# Altium project test_nvme.PrjPcb
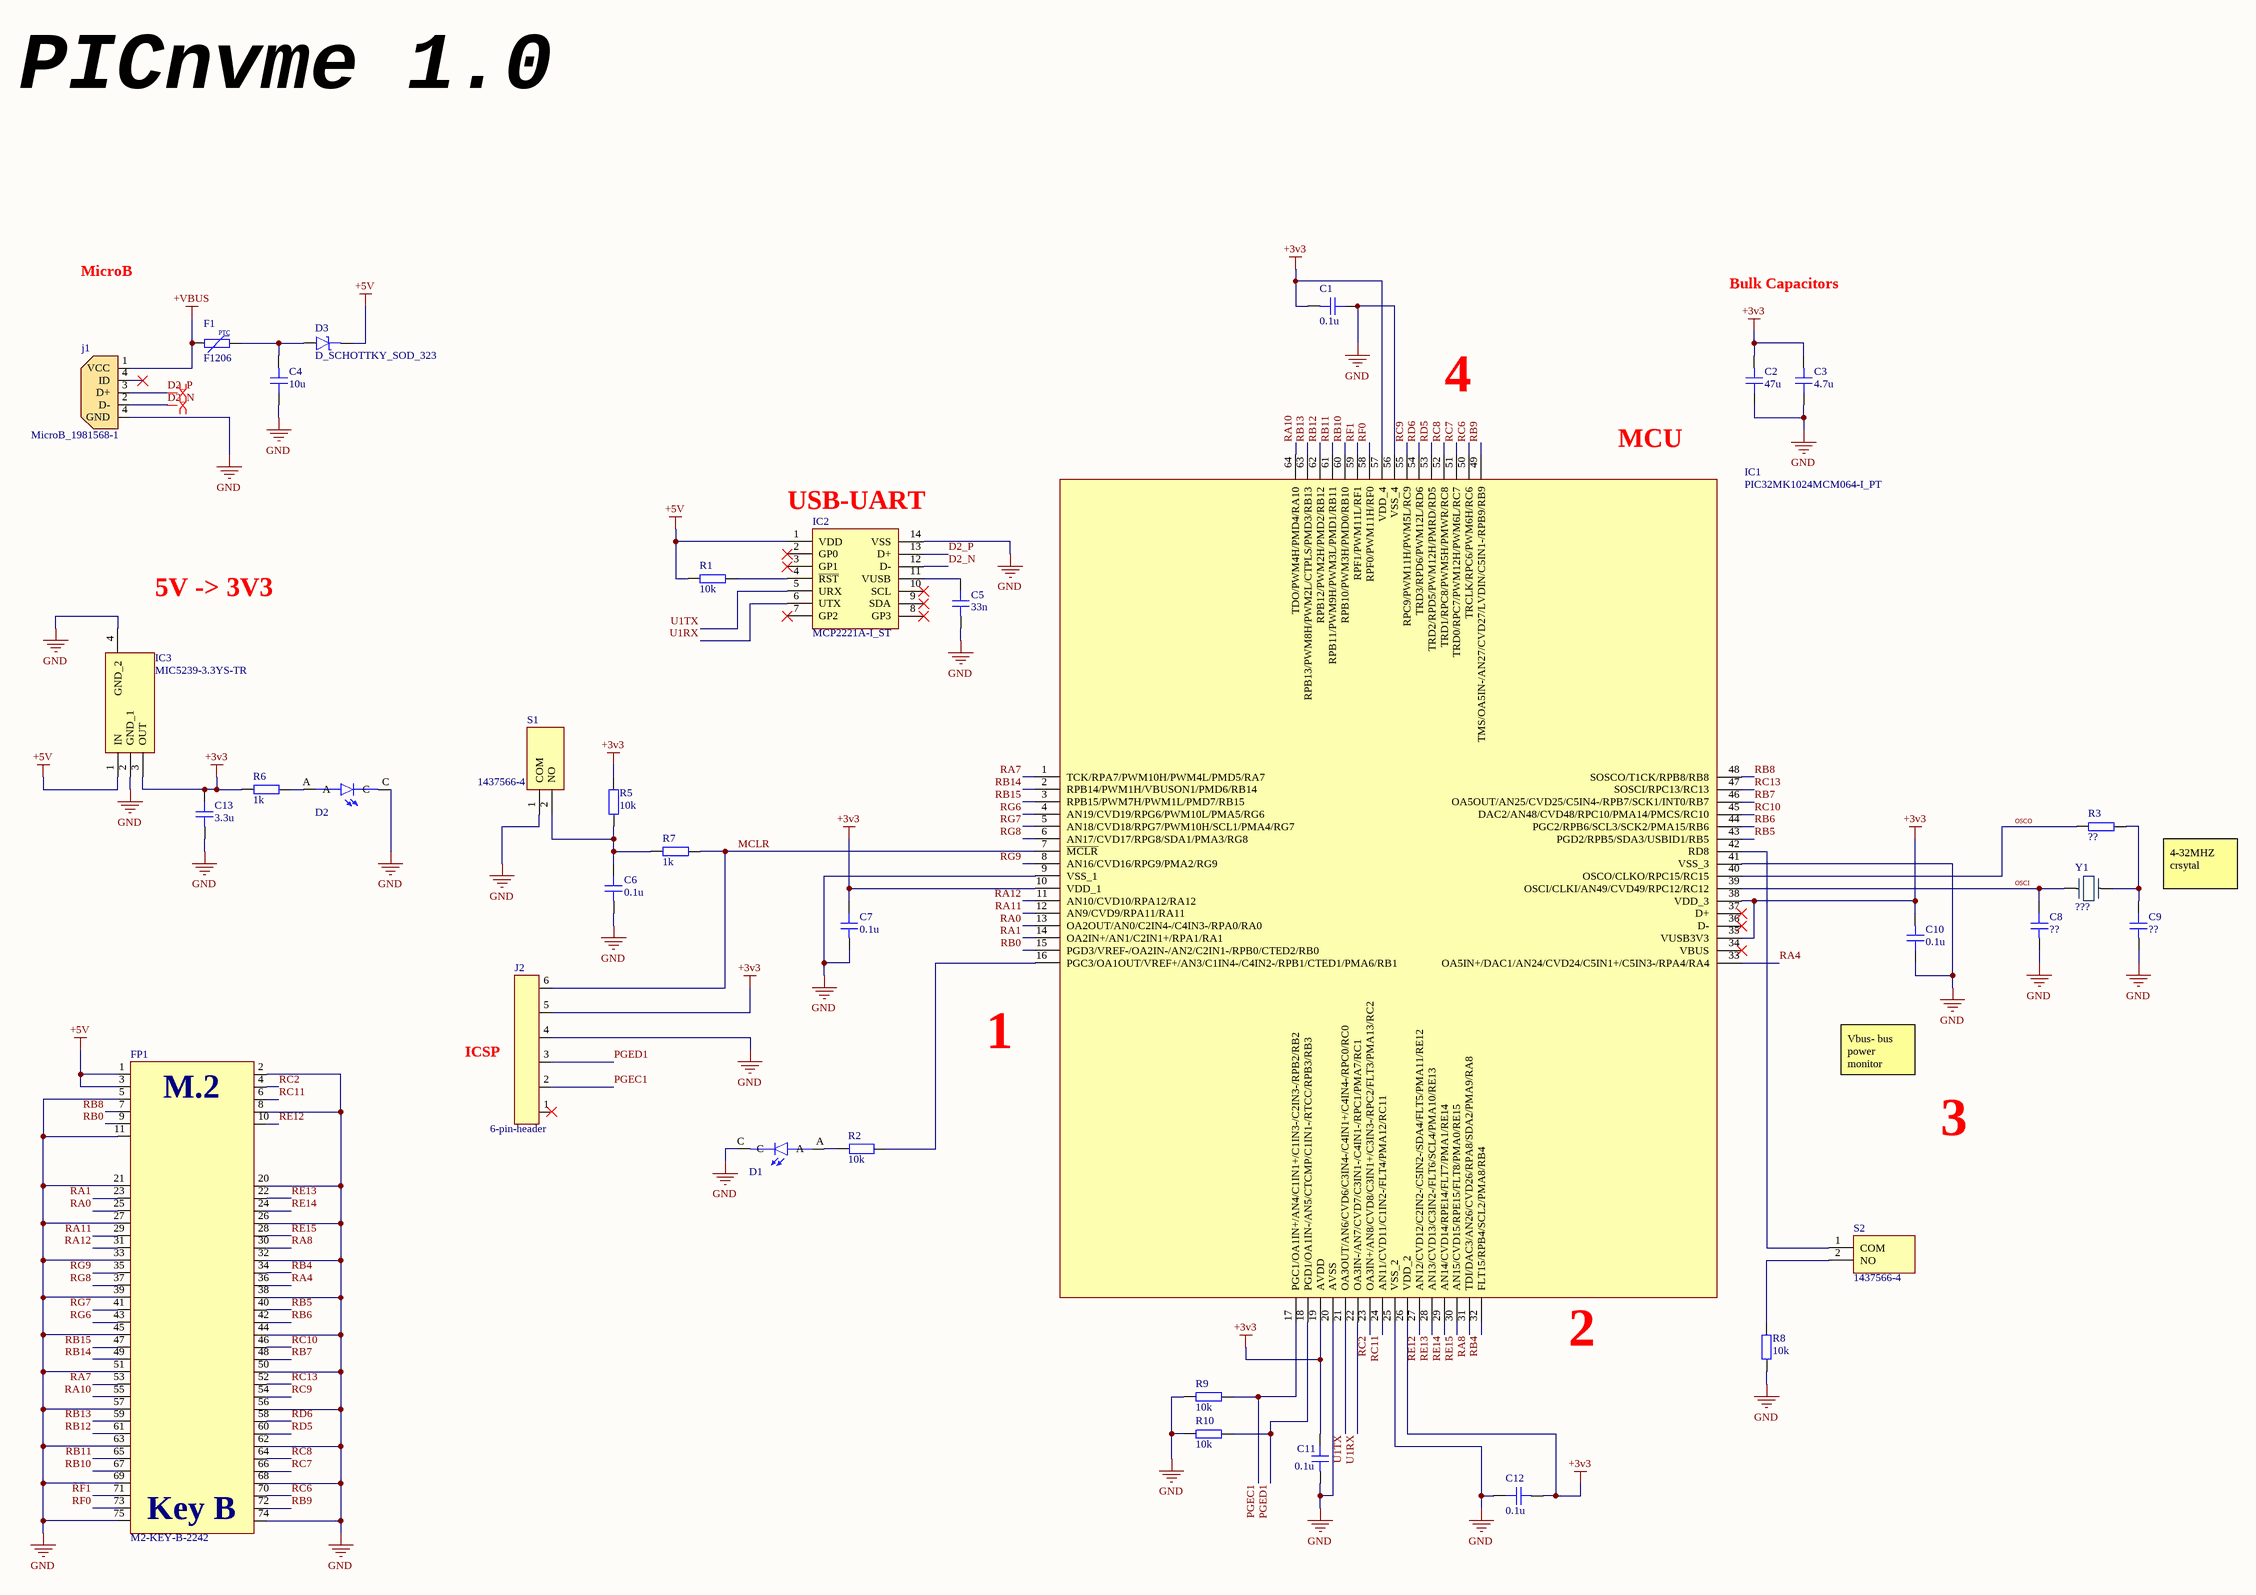
[diagram p0: Sheet1.SchDoc]
1 sheet, 35 parts. Net scope: global (net labels, ports and power ports of the same name join across sheets).
Board file: PCB1.PcbDoc

## Sheet Sheet1.SchDoc
size A2; SheetNumber: 1; SheetTotal: 1

### Parts
C1  0.1u  [CAP_0805]
C2  47u  [CAP_0805]
C3  4.7u  [CAP_0805]
C4  10u  [CAP_0805]
C5  33n  [CAP_0805]
C6  0.1u  [CAP_0805]
C7  0.1u  [CAP_0805]
C8  ??  [CAP_0805]
C9  ??  [CAP_0805]
C10  0.1u  [CAP_0805]
C11  0.1u  [CAP_0805]
C12  0.1u  [CAP_0805]
C13  3.3u  [CAP_0805]
D1  SML-LXT0805IW-TR  [LEDC2012X120N]  (value not drawn)
D2  SML-LXT0805IW-TR  [LEDC2012X120N]  (value not drawn)
D3  D_SCHOTTKY_SOD_323  [SOD-323]
F1  F1206  [FUSE_1206]
FP1  M2-KEY-B-2242  [M2-KEY-B-2242]
IC1  PIC32MK1024MCM064-I_PT  [QFP50P1200X1200X120-64N]
IC2  MCP2221A-I_ST  [SOP65P640X120-14N]
IC3  MIC5239-3.3YS-TR  [SOT230P700X180-4N]
j1  MicroB_1981568-1  [1981568-1]
J2  6-pin-header  [G800W302018EU]
R1  10k  [RES_0805]
R2  10k  [RES_0805]
R3  ??  [RES_0805]
R5  10k  [RES_0805]
R6  1k  [RES_0805]
R7  1k  [RES_0805]
R8  10k  [RES_0805]
R9  10k  [RES_0805]
R10  10k  [RES_0805]
S1  1437566-4  [14375664]
S2  1437566-4  [14375664]
Y1  ???  [ABM38000MHZC4T]

### Nets
+3v3: C1.1 C2.1 C3.1 C7.2 C10.1 C11.2 C12.1 C13.2 IC1.10(VDD_1) IC1.19(AVDD) IC1.26(VDD_2) IC1.35(VUSB3V3) IC1.38(VDD_3) IC1.57(VDD_4) IC3.3(OUT) J2.5 R5.1 R6.2
+5V: D3.K FP1.1 FP1.3 IC2.1(VDD) IC3.1(IN) R1.1
+VBUS: F1.1 j1.1(VCC)
GND: C1.2 C2.2 C3.2 C4.2 C5.1 C6.1 C7.1 C8.1 C9.1 C10.2 C11.1 C12.2 C13.1 D1.C D2.C FP1.2 FP1.5 FP1.8 FP1.11 FP1.20 FP1.21 FP1.26 FP1.27 FP1.32 FP1.33 FP1.38 FP1.39 FP1.44 FP1.45 FP1.50 FP1.51 FP1.56 FP1.57 FP1.62 FP1.63 FP1.68 FP1.69 FP1.74 FP1.75 IC1.9(VSS_1) IC1.20(AVSS) IC1.25(VSS_2) IC1.41(VSS_3) IC1.56(VSS_4) IC2.14(VSS) IC3.2(GND_1) IC3.4(GND_2) j1.4(GND) J2.4 R8.2 R9.2 R10.2 S1.1(COM)
D2_N: IC2.12(D-) j1.2(D-)
D2_P: IC2.13(D+) j1.3(D+)
MCLR: IC1.7(~{MCLR}) J2.6 R7.1
OSCI: C8.2 IC1.39(OSCI/CLKI/AN49/CVD49/RPC12/RC12) Y1.1
OSCO: IC1.40(OSCO/CLKO/RPC15/RC15) R3.2
PGEC1: IC1.17(PGC1/OA1IN+/AN4/C1IN1+/C1IN3-/C2IN3-/RPB2/RB2) J2.2 R9.1
PGED1: IC1.18(PGD1/OA1IN-/AN5/CTCMP/C1IN1-/RTCC/RPB3/RB3) J2.3 R10.1
RA0: FP1.25 IC1.13(OA2OUT/AN0/C2IN4-/C4IN3-/RPA0/RA0)
RA1: FP1.23 IC1.14(OA2IN+/AN1/C2IN1+/RPA1/RA1)
RA4: FP1.36 IC1.33(OA5IN+/DAC1/AN24/CVD24/C5IN1+/C5IN3-/RPA4/RA4)
RA7: FP1.53 IC1.1(TCK/RPA7/PWM10H/PWM4L/PMD5/RA7)
RA8: FP1.30 IC1.31(TDI/DAC3/AN26/CVD26/RPA8/SDA2/PMA9/RA8)
RA10: FP1.55 IC1.64(TDO/PWM4H/PMD4/RA10)
RA11: FP1.29 IC1.12(AN9/CVD9/RPA11/RA11)
RA12: FP1.31 IC1.11(AN10/CVD10/RPA12/RA12)
RB0: FP1.9 IC1.15(PGD3/VREF-/OA2IN-/AN2/C2IN1-/RPB0/CTED2/RB0)
RB4: FP1.34 IC1.32(FLT15/RPB4/SCL2/PMA8/RB4)
RB5: FP1.40 IC1.43(PGD2/RPB5/SDA3/USBID1/RB5)
RB6: FP1.42 IC1.44(PGC2/RPB6/SCL3/SCK2/PMA15/RB6)
RB7: FP1.48 IC1.46(OA5OUT/AN25/CVD25/C5IN4-/RPB7/SCK1/INT0/RB7)
RB8: FP1.7 IC1.48(SOSCO/T1CK/RPB8/RB8)
RB9: FP1.72 IC1.49(TMS/OA5IN-/AN27/CVD27/LVDIN/C5IN1-/RPB9/RB9)
RB10: FP1.67 IC1.60(RPB10/PWM3H/PMD0/RB10)
RB11: FP1.65 IC1.61(RPB11/PWM9H/PWM3L/PMD1/RB11)
RB12: FP1.61 IC1.62(RPB12/PWM2H/PMD2/RB12)
RB13: FP1.59 IC1.63(RPB13/PWM8H/PWM2L/CTPLS/PMD3/RB13)
RB14: FP1.49 IC1.2(RPB14/PWM1H/VBUSON1/PMD6/RB14)
RB15: FP1.47 IC1.3(RPB15/PWM7H/PWM1L/PMD7/RB15)
RC2: FP1.4 IC1.23(OA3IN+/AN8/CVD8/C3IN1+/C3IN3-/RPC2/FLT3/PMA13/RC2)
RC6: FP1.70 IC1.50(TRCLK/RPC6/PWM6H/RC6)
RC7: FP1.66 IC1.51(TRD0/RPC7/PWM12H/PWM6L/RC7)
RC8: FP1.64 IC1.52(TRD1/RPC8/PWM5H/PMWR/RC8)
RC9: FP1.54 IC1.55(RPC9/PWM11H/PWM5L/RC9)
RC10: FP1.46 IC1.45(DAC2/AN48/CVD48/RPC10/PMA14/PMCS/RC10)
RC11: FP1.6 IC1.24(AN11/CVD11/C1IN2-/FLT4/PMA12/RC11)
RC13: FP1.52 IC1.47(SOSCI/RPC13/RC13)
RD5: FP1.60 IC1.53(TRD2/RPD5/PWM12H/PMRD/RD5)
RD6: FP1.58 IC1.54(TRD3/RPD6/PWM12L/RD6)
RE12: FP1.10 IC1.27(AN12/CVD12/C2IN2-/C5IN2-/SDA4/FLT5/PMA11/RE12)
RE13: FP1.22 IC1.28(AN13/CVD13/C3IN2-/FLT6/SCL4/PMA10/RE13)
RE14: FP1.24 IC1.29(AN14/CVD14/RPE14/FLT7/PMA1/RE14)
RE15: FP1.28 IC1.30(AN15/CVD15/RPE15/FLT8/PMA0/RE15)
RF0: FP1.73 IC1.58(RPF0/PWM11H/RF0)
RF1: FP1.71 IC1.59(RPF1/PWM11L/RF1)
RG6: FP1.43 IC1.4(AN19/CVD19/RPG6/PWM10L/PMA5/RG6)
RG7: FP1.41 IC1.5(AN18/CVD18/RPG7/PWM10H/SCL1/PMA4/RG7)
RG8: FP1.37 IC1.6(AN17/CVD17/RPG8/SDA1/PMA3/RG8)
RG9: FP1.35 IC1.8(AN16/CVD16/RPG9/PMA2/RG9)
U1RX: IC1.22(OA3IN-/AN7/CVD7/C3IN1-/C4IN1-/RPC1/PMA7/RC1) IC2.6(UTX)
U1TX: IC1.21(OA3OUT/AN6/CVD6/C3IN4-/C4IN1+/C4IN4-/RPC0/RC0) IC2.5(URX)
NetC4_1: C4.1 D3.A F1.2
NetC5_2: C5.2 IC2.11(VUSB)
NetC6_2: C6.2 R5.2 R7.2 S1.2(NO)
NetC9_2: C9.2 R3.1 Y1.2
NetD1_A: D1.A R2.2
NetD2_A: D2.A R6.1
NetIC1_16: IC1.16(PGC3/OA1OUT/VREF+/AN3/C1IN4-/C4IN2-/RPB1/CTED1/PMA6/RB1) R2.1
NetIC1_42: IC1.42(RD8) S2.1(COM)
NetIC2_4: IC2.4(~{RST}) R1.2
NetR8_1: R8.1 S2.2(NO)

Not connected (* = marked no-connect by the designer): IC1 34(VBUS)* 36(D-)* 37(D+)*; IC2 2(GP0)* 3(GP1)* 7(GP2)* 8(GP3)* 9(SDA)* 10(SCL)*; J2 1*

### Layout directives
differential pair; net class DIFF_USB: D2_N, D2_P

### Notes on the sheet
- PICnvme 1.0
- MicroB
- Bulk Capacitors
- 4
- (near IC1) MCU
- (near IC2) USB-UART
- 5V -> 3V3
- 4-32MHZ crsytal
- (near J2) ICSP
- (near IC1) 1
- Vbus- bus power monitor
- 3
- (near IC1) 2
- (in symbol FUSE_PPTC_1206) PTC
- (in symbol M2-KEY-B-2242) M.2; Key B

### Library data of the parts
C1-C3 C6-C13 = CAP_0805_16V: Capacitor SMD 0805 16V
C4 C5 = CAP_0805_10V: Capacitor SMD 0805 10V
D1 D2 = SML-LXT0805IW-TR: Red - LED Indication - Discrete 2V 0805 (2012 Metric); MF: Lumex Opto/Components; Check_prices: https://www.snapeda.com/parts/SML-LXT0805IW-TR/Lumex+Opto%252FComponents+Inc./view-part/?ref=eda; Price: None; MP: SML-LXT0805IW-TR; SnapEDA_Link: https://www.snapeda.com/parts/SML-LXT0805IW-TR/Lumex+Opto%252FComponents+Inc./view-part/?ref=snap; Availability: In Stock; Value: *; Purchase-URL: https://pricing.snapeda.com/search/part/SML-LXT0805IW-TR/?ref=eda; Package: 0805 Lumex
D3 = D_SCHOTTKY_SOD_323: Diode Schottky SMD SOD-323
F1 = FUSE_PPTC_1206: Fuse PPTC SMD 1206; Manufacturer: *; Manufacturer Part Number: *
FP1 = M2-KEY-B-2242: M.2 Key B 22x42 Footprint
IC1 = PIC32MK1024MCM064-I_PT: Integrated Circuit; Manufacturer_Name: Microchip; Manufacturer_Part_Number: PIC32MK1024MCM064-I/PT; Datasheet Link: https://ww1.microchip.com/downloads/aemDocuments/documents/MCU32/ProductDocuments/DataSheets/PIC32MK-GPK-MCM-with-CAN-FD-Family-DataSheet-DS60001519E.pdf; Height: 1.2mm; Mouser Part Number: 579-2MK1024MCM064IPT; Mouser Price/Stock: https://www.mouser.co.uk/ProductDetail/Microchip-Technology/PIC32MK1024MCM064-I-PT?qs=W%2FMpXkg%252BdQ4dBI32NJdQMg%3D%3D; Arrow Part Number: PIC32MK1024MCM064-I/PT; Arrow Price/Stock: https://www.arrow.com/en/products/pic32mk1024mcm064-ipt/microchip-technology?region=nac
IC2 = MCP2221A-I_ST: Integrated Circuit; Manufacturer_Name: Microchip; Manufacturer_Part_Number: MCP2221A-I/ST; Datasheet Link: http://ww1.microchip.com/downloads/en/devicedoc/20005565b.pdf; Height: 1.2mm; Mouser Part Number: 579-MCP2221A-I/ST; Mouser Price/Stock: https://www.mouser.co.uk/ProductDetail/Microchip-Technology/MCP2221A-I-ST?qs=ZEMkBHnybREMkqMgzOrcGQ%3D%3D; Arrow Part Number: MCP2221A-I/ST; Arrow Price/Stock: https://www.arrow.com/en/products/mcp2221a-ist/microchip-technology?region=nac
IC3 = MIC5239-3.3YS-TR: Integrated Circuit; Manufacturer_Name: Microchip; Datasheet Link: https://ww1.microchip.com/downloads/en/DeviceDoc/mic5239.pdf; Height: 1.8mm; Manufacturer_Part_Number: MIC5239-3.3YS-TR; Mouser Part Number: 998-MIC5239-3.3YSTR; Mouser Price/Stock: https://www.mouser.co.uk/ProductDetail/Microchip-Technology-Micrel/MIC5239-33YS-TR?qs=U6T8BxXiZAXN0UitWWB92A%3D%3D; Arrow Part Number: MIC5239-3.3YS-TR; Arrow Price/Stock: https://www.arrow.com/en/products/mic5239-3.3ys-tr/microchip-technology?region=nac
j1 = Micro_B
J2 = G800W302018EU: Pin Header 6 Position 2.54mm Pitch; Manufacturer: Amphenol; Manufacturer Part Number: G800W302018EU
R1-R3 R5-R10 = RES_0805: Resistor SMD 0805
S1 S2 = 1437566-4: Switch; Manufacturer_Name: TE Connectivity; Datasheet Link: https://www.te.com/commerce/DocumentDelivery/DDEController?Action=showdoc&DocId=Customer+Drawing%7F1437566-3%7FC2%7Fpdf%7FEnglish%7FENG_CD_1437566-3_C7F14375662_1437566_3_1_c.dwg.pdf%-4; Height: 4.87mm; Manufacturer_Part_Number: 1437566-4; Mouser Part Number: N/A; Mouser Price/Stock: https://www.mouser.co.uk/ProductDetail/TE-Connectivity-Alcoswitch/1437566-4?qs=xoXDFGdkQ2nbcMrTmW1sHA%3D%3D; Arrow Part Number: 1437566-4; Arrow Price/Stock: https://www.arrow.com/en/products/1437566-4/te-connectivity?region=europe
Y1 = Crystal_SMD